# Altium schematic sheet GPRS.SchDoc
size A3
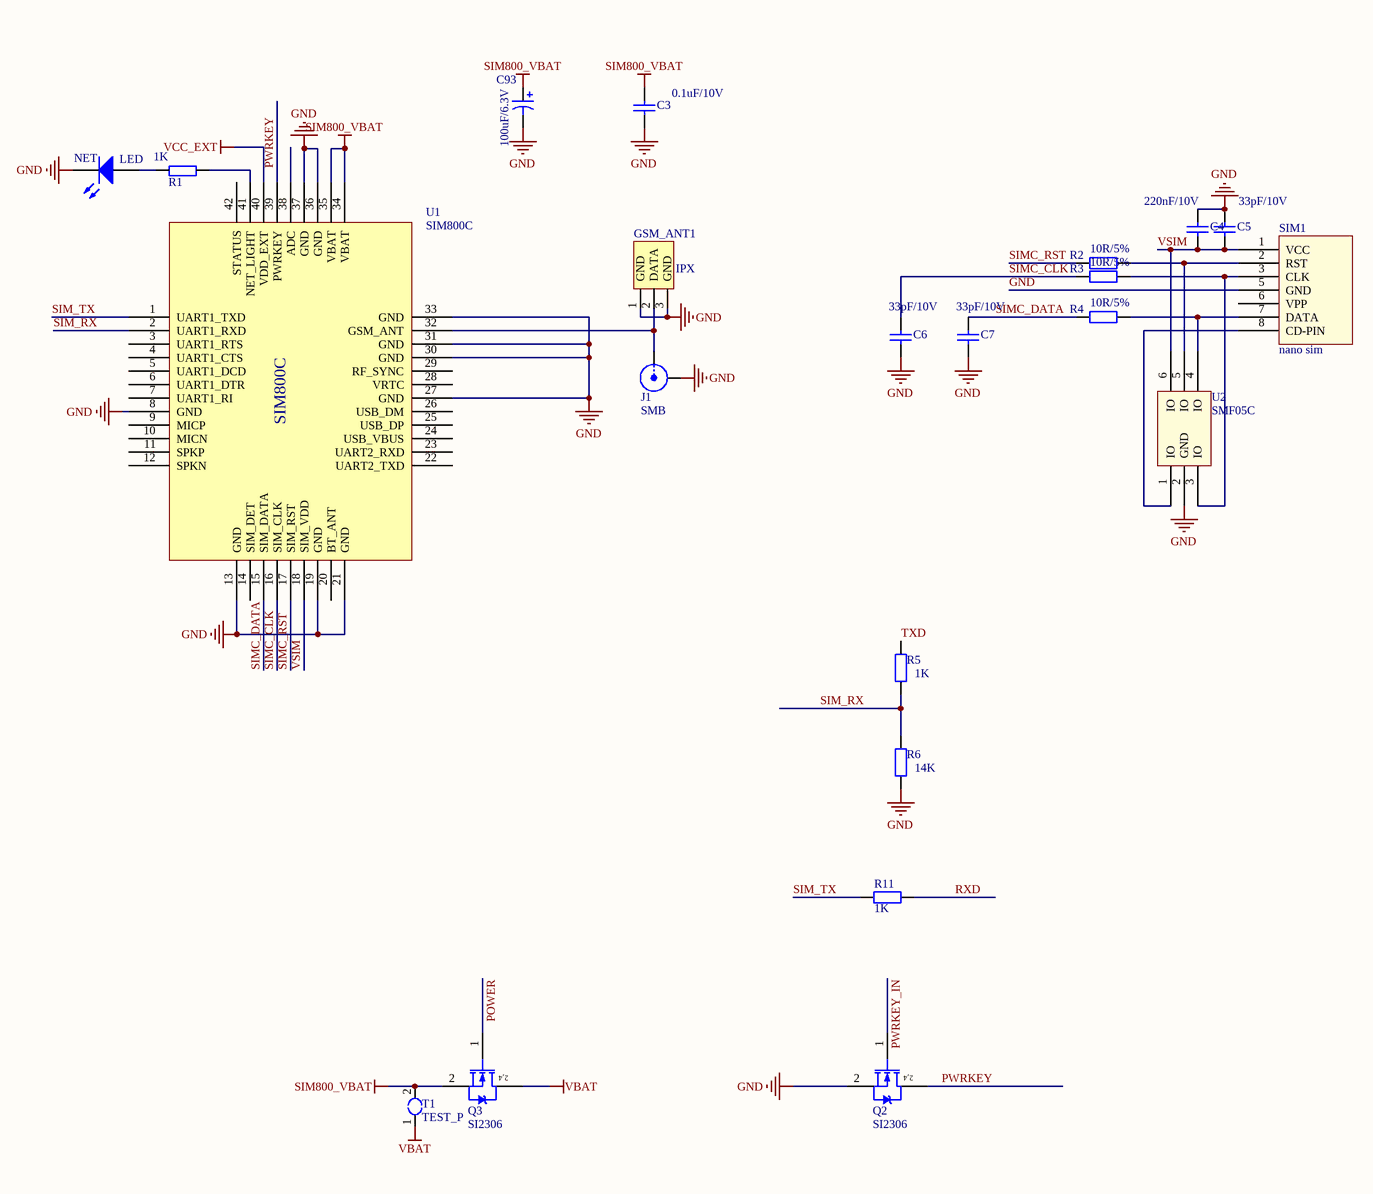
[diagram p0: GPRS.SchDoc]

## Parts
C3  0.1uF/10V  [0603C]
C4  220nF/10V  [0603C]
C5  33pF/10V  [0603C]
C6  33pF/10V  [0603C]
C7  33pF/10V  [0603C]
C93  100uF/6.3V  [7343]
GSM_ANT1  IPX  [IPX]
J1  SMB  [SMA END LAUNCH JACK RECEPTACLE SHORT]
NET  LED  [0603LED]
Q2  SI2306  [SOT23-3]
Q3  SI2306  [SOT23-3]
R1  1K  [0603r]
R2  10R/5%  [0603R]
R3  10R/5%  [0603R]
R4  10R/5%  [0603R]
R5  1K  [0603R]
R6  14K  [0603R]
R11  1K  [0603R]
SIM1  nano sim  [Nano SIM]
T1  TEST_P  [TEST_P]
U1  SIM800C  [SIM800C]
U2  SMF05C  [SC70-6L]

## Nets
GND: C3.2 C4.1 C5.1 C6.2 C7.2 C93.2 GSM_ANT1.1(GND) GSM_ANT1.3(GND) J1.2(Y) NET.2(K) Q2.2(S) R6.2 SIM1.5(GND) U1.8(GND) U1.13(GND) U1.19(GND) U1.21(GND) U1.27(GND) U1.30(GND) U1.31(GND) U1.33(GND) U1.36(GND) U1.37(GND) U2.2(GND)
SIM800_VBAT: C3.1 C93.1 Q3.2(S) T1.2 U1.34(VBAT) U1.35(VBAT)
VBAT: Q3.3(D) T1.1
VCC_EXT: U1.40(VDD_EXT)
POWER: Q3.1(G)
PWRKEY: Q2.3(D) U1.39(PWRKEY)
PWRKEY_IN: Q2.1(G)
RXD: R11.2
SIM_RX: R5.2 R6.1 U1.2(UART1_RXD)
SIM_TX: R11.1 U1.1(UART1_TXD)
SIMC_CLK: C6.1 R3.2 U1.16(SIM_CLK)
SIMC_DATA: C7.1 R4.2 U1.15(SIM_DATA)
SIMC_RST: R2.2 U1.17(SIM_RST)
TXD: R5.1
VSIM: C4.2 C5.2 SIM1.1(VCC) U1.18(SIM_VDD) U2.6(IO)
NetGSM_ANT1_2: GSM_ANT1.2(DATA) J1.1(X) U1.32(GSM_ANT)
NetNET_1: NET.1(A) R1.1
NetR1_2: R1.2 U1.41(NET_LIGHT)
NetR2_1: R2.1 SIM1.2(RST) U2.5(IO)
NetR3_1: R3.1 SIM1.3(CLK) U2.3(IO)
NetR4_1: R4.1 SIM1.7(DATA) U2.4(IO)
NetSIM1_8: SIM1.8(CD-PIN) U2.1(IO)

Not connected (* = marked no-connect by the designer): SIM1 6(VPP); U1 3(UART1_RTS) 4(UART1_CTS) 5(UART1_DCD) 6(UART1_DTR) 7(UART1_RI) 9(MICP) 10(MICN) 11(SPKP) 12(SPKN) 14(SIM_DET) 20(BT_ANT) 22(UART2_TXD) 23(UART2_RXD) 24(USB_VBUS) 25(USB_DP) 26(USB_DM) 28(VRTC) 29(RF_SYNC) 38(ADC) 42(STATUS)

## Notes on the sheet
- (in symbol BUK92150-55A) 2,4

## Library data of the parts
C3 = Cap: Capacitor; Published: 8-Jun-2000; LatestRevisionDate: 17-Jul-2002; LatestRevisionNote: Re-released for DXP Platform.; PackageReference: RAD-0.3; Publisher: Altium Limited; Value: 0.1uF/10V
C4-C7 = Cap: Capacitor; Value: 0.1uF/10V; Published: 8-Jun-2000; LatestRevisionDate: 17-Jul-2002; LatestRevisionNote: Re-released for DXP Platform.; PackageReference: RAD-0.3; Publisher: Altium Limited
C93 = Cap Pol1: Polarized Capacitor (Radial); Published: 8-Jun-2000; LatestRevisionDate: 17-Jul-2002; LatestRevisionNote: Re-released for DXP Platform.; PackageReference: RB7.6-15; Publisher: Altium Limited
GSM_ANT1 = IPEX: IPEX座
J1 = SMB: SMB Straight Connector; LatestRevisionDate: 17-Jul-2002; LatestRevisionNote: Re-released for DXP Platform.; Publisher: Altium Limited
NET = LED2: Typical RED, GREEN, YELLOW, AMBER GaAs LED; Published: 8-Jun-2000; LatestRevisionDate: 17-Jul-2002; LatestRevisionNote: Re-released for DXP Platform.; PackageDocument: Feb-2002; PackageReference: 3.2X1.6X1.1; Publisher: Altium Limited
Q2 Q3 = BUK92150-55A: Published: 8-Jun-2000; LatestRevisionDate: 17-Jul-2002; LatestRevisionNote: Re-released for DXP Platform.; DatasheetVersion: 6-Oct-1997; PackageVersion: Aug-1998; PackageReference: TSOP-6; Publisher: Altium Limited; PackageDescription: SOT-457/SC-74; 6 Leads; Body 3.1 x 3 mm, inc. leads (LxW max); ComponentLink1Description: Manufacturer Link; ComponentLink1URL: http://www.vishay.com/; ComponentLink2Description: Datasheet; ComponentLink2URL: http://www.vishay.com/docs/70192/70192.pdf
R1 = R
R2-R4 = Res2: Resistor; Value: 10R; Published: 8-Jun-2000; LatestRevisionDate: 17-Jul-2002; LatestRevisionNote: Re-released for DXP Platform.; PackageReference: AXIAL-0.4; Publisher: Altium Limited
R5 R6 R11 = Res2: Resistor; Value: 0; Published: 8-Jun-2000; LatestRevisionDate: 17-Jul-2002; LatestRevisionNote: Re-released for DXP Platform.; PackageReference: AXIAL-0.4; Publisher: Altium Limited